# EAGLE schematic dashboard (EAGLE 6.3)
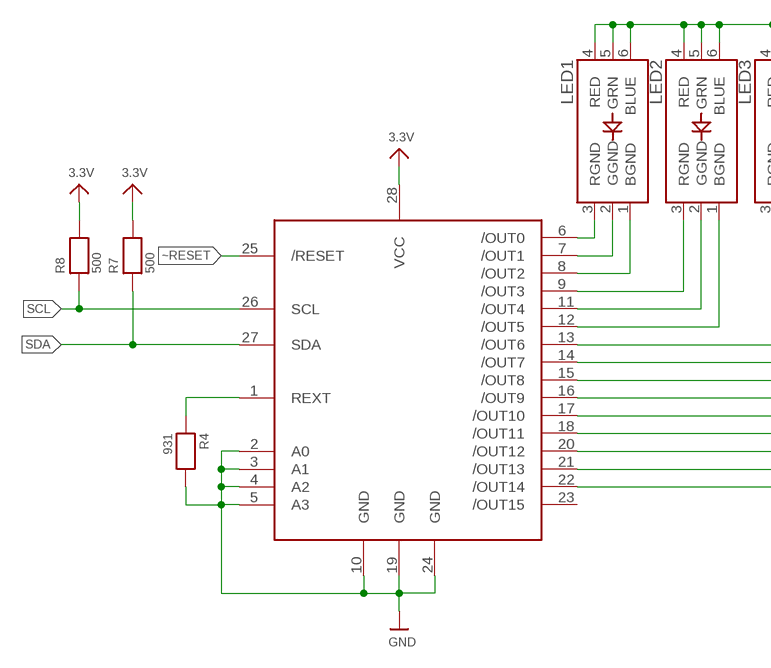
[diagram p0: schematic, sheet 1, part 1 of 2]
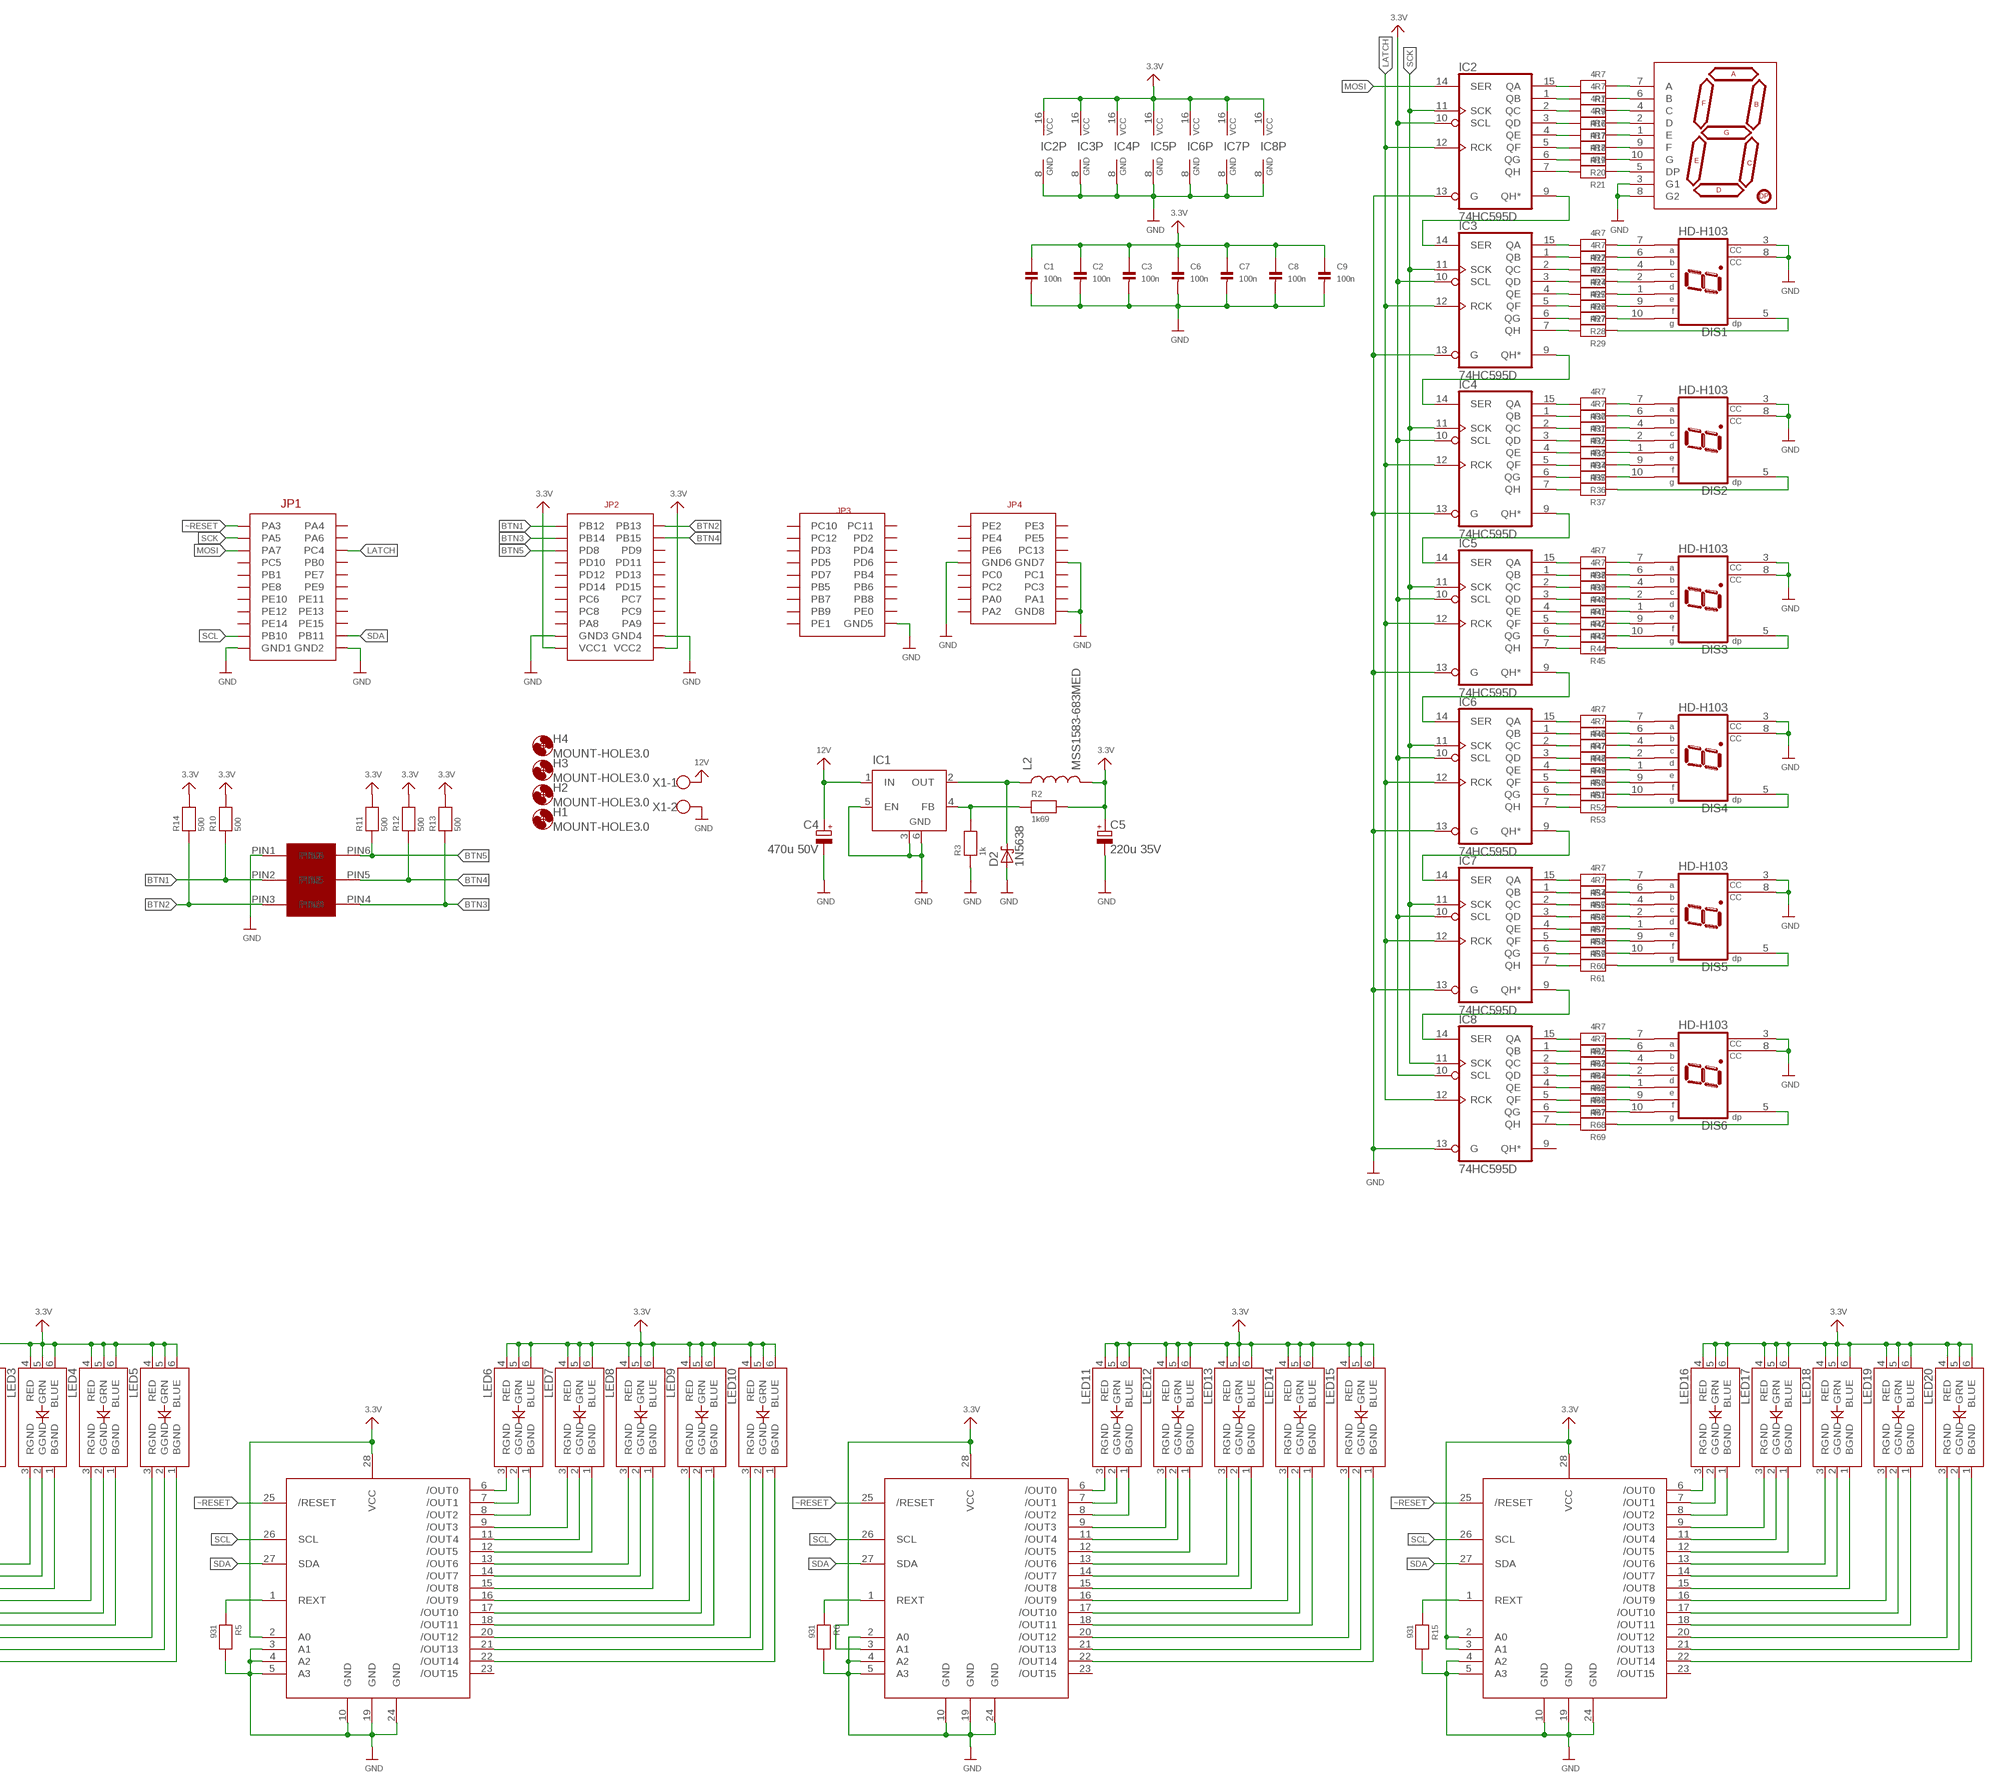
[diagram p1: schematic, sheet 1, part 2 of 2]

## Parts
C1  100n  CAP_CERAMIC_0603  [_0603]
C2  100n  CAP_CERAMIC_0603  [_0603]
C3  100n  CAP_CERAMIC_0603  [_0603]
C4  470u 50V  CPOL-EUE5-13  [E5-13]
C5  220u 35V  CPOL-EUE3.5-8  [E3,5-8]
C6  100n  CAP_CERAMIC_0603  [_0603]
C7  100n  CAP_CERAMIC_0603  [_0603]
C8  100n  CAP_CERAMIC_0603  [_0603]
C9  100n  CAP_CERAMIC_0603  [_0603]
D2  1N5638  [DO13M]
DIS1  HD-H103  [HDSP-M]
DIS2  HD-H103  [HDSP-M]
DIS3  HD-H103  [HDSP-M]
DIS4  HD-H103  [HDSP-M]
DIS5  HD-H103  [HDSP-M]
DIS6  HD-H103  [HDSP-M]
H1  MOUNT-HOLE3.0  [3,0]
H2  MOUNT-HOLE3.0  [3,0]
H3  MOUNT-HOLE3.0  [3,0]
H4  MOUNT-HOLE3.0  [3,0]
IC1  LM2596S  [TO263-5]
IC2  74HC595D  [SO16]
IC3  74HC595D  [SO16]
IC4  74HC595D  [SO16]
IC5  74HC595D  [SO16]
IC6  74HC595D  [SO16]
IC7  74HC595D  [SO16]
IC8  74HC595D  [SO16]
L2  MSS1583-683MED  INDUCTORPWR  [CDRH125]
LED1  LED_RGB_PLCC6CREE-CLV6A  [RGBLED_PLCC6]
LED2  LED_RGB_PLCC6CREE-CLV6A  [RGBLED_PLCC6]
LED3  LED_RGB_PLCC6CREE-CLV6A  [RGBLED_PLCC6]
LED4  LED_RGB_PLCC6CREE-CLV6A  [RGBLED_PLCC6]
LED5  LED_RGB_PLCC6CREE-CLV6A  [RGBLED_PLCC6]
LED6  LED_RGB_PLCC6CREE-CLV6A  [RGBLED_PLCC6]
LED7  LED_RGB_PLCC6CREE-CLV6A  [RGBLED_PLCC6]
LED8  LED_RGB_PLCC6CREE-CLV6A  [RGBLED_PLCC6]
LED9  LED_RGB_PLCC6CREE-CLV6A  [RGBLED_PLCC6]
LED10  LED_RGB_PLCC6CREE-CLV6A  [RGBLED_PLCC6]
LED11  LED_RGB_PLCC6CREE-CLV6A  [RGBLED_PLCC6]
LED12  LED_RGB_PLCC6CREE-CLV6A  [RGBLED_PLCC6]
LED13  LED_RGB_PLCC6CREE-CLV6A  [RGBLED_PLCC6]
LED14  LED_RGB_PLCC6CREE-CLV6A  [RGBLED_PLCC6]
LED15  LED_RGB_PLCC6CREE-CLV6A  [RGBLED_PLCC6]
LED16  LED_RGB_PLCC6CREE-CLV6A  [RGBLED_PLCC6]
LED17  LED_RGB_PLCC6CREE-CLV6A  [RGBLED_PLCC6]
LED18  LED_RGB_PLCC6CREE-CLV6A  [RGBLED_PLCC6]
LED19  LED_RGB_PLCC6CREE-CLV6A  [RGBLED_PLCC6]
LED20  LED_RGB_PLCC6CREE-CLV6A  [RGBLED_PLCC6]
R1  4R7  RESISTOR_0603  [_0603]
R2  1k69  RESISTOR_0603  [_0603]
R3  1k  RESISTOR_0603  [_0603]
R4  931  RESISTOR_0603  [_0603]
R5  931  RESISTOR_0603  [_0603]
R6  931  RESISTOR_0603  [_0603]
R7  500  RESISTOR_0603  [_0603]
R8  500  RESISTOR_0603  [_0603]
R9  4R7  RESISTOR_0603  [_0603]
R10  500  RESISTOR_0805  [_0805]
R11  500  RESISTOR_0805  [_0805]
R12  500  RESISTOR_0805  [_0805]
R13  500  RESISTOR_0805  [_0805]
R14  500  RESISTOR_0805  [_0805]
R15  931  RESISTOR_0603  [_0603]
R16  4R7  RESISTOR_0603  [_0603]
R17  4R7  RESISTOR_0603  [_0603]
R18  4R7  RESISTOR_0603  [_0603]
R19  4R7  RESISTOR_0603  [_0603]
R20  4R7  RESISTOR_0603  [_0603]
R21  4R7  RESISTOR_0603  [_0603]
R22  4R7  RESISTOR_0603  [_0603]
R23  4R7  RESISTOR_0603  [_0603]
R24  4R7  RESISTOR_0603  [_0603]
R25  4R7  RESISTOR_0603  [_0603]
R26  4R7  RESISTOR_0603  [_0603]
R27  4R7  RESISTOR_0603  [_0603]
R28  4R7  RESISTOR_0603  [_0603]
R29  4R7  RESISTOR_0603  [_0603]
R30  4R7  RESISTOR_0603  [_0603]
R31  4R7  RESISTOR_0603  [_0603]
R32  4R7  RESISTOR_0603  [_0603]
R33  4R7  RESISTOR_0603  [_0603]
R34  4R7  RESISTOR_0603  [_0603]
R35  4R7  RESISTOR_0603  [_0603]
R36  4R7  RESISTOR_0603  [_0603]
R37  4R7  RESISTOR_0603  [_0603]
R38  4R7  RESISTOR_0603  [_0603]
R39  4R7  RESISTOR_0603  [_0603]
R40  4R7  RESISTOR_0603  [_0603]
R41  4R7  RESISTOR_0603  [_0603]
R42  4R7  RESISTOR_0603  [_0603]
R43  4R7  RESISTOR_0603  [_0603]
R44  4R7  RESISTOR_0603  [_0603]
R45  4R7  RESISTOR_0603  [_0603]
R46  4R7  RESISTOR_0603  [_0603]
R47  4R7  RESISTOR_0603  [_0603]
R48  4R7  RESISTOR_0603  [_0603]
R49  4R7  RESISTOR_0603  [_0603]
R50  4R7  RESISTOR_0603  [_0603]
R51  4R7  RESISTOR_0603  [_0603]
R52  4R7  RESISTOR_0603  [_0603]
R53  4R7  RESISTOR_0603  [_0603]
R54  4R7  RESISTOR_0603  [_0603]
R55  4R7  RESISTOR_0603  [_0603]
R56  4R7  RESISTOR_0603  [_0603]
R57  4R7  RESISTOR_0603  [_0603]
R58  4R7  RESISTOR_0603  [_0603]
R59  4R7  RESISTOR_0603  [_0603]
R60  4R7  RESISTOR_0603  [_0603]
R61  4R7  RESISTOR_0603  [_0603]
R62  4R7  RESISTOR_0603  [_0603]
R63  4R7  RESISTOR_0603  [_0603]
R64  4R7  RESISTOR_0603  [_0603]
R65  4R7  RESISTOR_0603  [_0603]
R66  4R7  RESISTOR_0603  [_0603]
R67  4R7  RESISTOR_0603  [_0603]
R68  4R7  RESISTOR_0603  [_0603]
R69  4R7  RESISTOR_0603  [_0603]
U$1  CPU-BOARD  [CPU-BOARD-JP1]
U$9  7-SEGMENT-DISPLAY-1"-RED  [7-SEGMENT-1"PTH]
U$30  TLC59116  [TSSOP28]
U$33  TLC59116  [TSSOP28]
U$36  TLC59116  [TSSOP28]
U$42  MICROFIT6  [MICROFIT6SOCK]
U$51  TLC59116  [TSSOP28]
X1  W237-102  [W237-102]

## Nets
3.3V: C1.1 C2.1 C3.1 C5.+ C6.1 C7.1 C8.1 C9.1 IC2.10(SCL) IC2.16(VCC) IC3.10(SCL) IC3.16(VCC) IC4.10(SCL) IC4.16(VCC) IC5.10(SCL) IC5.16(VCC) IC6.10(SCL) IC6.16(VCC) IC7.10(SCL) IC7.16(VCC) IC8.10(SCL) IC8.16(VCC) L2.2 LED1.4(RED) LED1.5(GRN) LED1.6(BLUE) LED2.4(RED) LED2.5(GRN) LED2.6(BLUE) LED3.4(RED) LED3.5(GRN) LED3.6(BLUE) LED4.4(RED) LED4.5(GRN) LED4.6(BLUE) LED5.4(RED) LED5.5(GRN) LED5.6(BLUE) LED6.4(RED) LED6.5(GRN) LED6.6(BLUE) LED7.4(RED) LED7.5(GRN) LED7.6(BLUE) LED8.4(RED) LED8.5(GRN) LED8.6(BLUE) LED9.4(RED) LED9.5(GRN) LED9.6(BLUE) LED10.4(RED) LED10.5(GRN) LED10.6(BLUE) LED11.4(RED) LED11.5(GRN) LED11.6(BLUE) LED12.4(RED) LED12.5(GRN) LED12.6(BLUE) LED13.4(RED) LED13.5(GRN) LED13.6(BLUE) LED14.4(RED) LED14.5(GRN) LED14.6(BLUE) LED15.4(RED) LED15.5(GRN) LED15.6(BLUE) LED16.4(RED) LED16.5(GRN) LED16.6(BLUE) LED17.4(RED) LED17.5(GRN) LED17.6(BLUE) LED18.4(RED) LED18.5(GRN) LED18.6(BLUE) LED19.4(RED) LED19.5(GRN) LED19.6(BLUE) LED20.4(RED) LED20.5(GRN) LED20.6(BLUE) R2.2 R7.2 R8.2 R10.2 R11.2 R12.2 R13.2 R14.2 U$1.P$43(VCC1) U$1.P$44(VCC2) U$30.28(VCC) U$33.2(A0) U$33.28(VCC) U$36.3(A1) U$36.28(VCC) U$51.2(A0) U$51.3(A1) U$51.28(VCC)
12V: C4.+ IC1.1(IN) X1.1
BTN1: R10.1 U$1.P$23(PB12) U$42.PIN2
BTN2: R14.1 U$1.P$24(PB13) U$42.PIN3
BTN3: R13.1 U$1.P$25(PB14) U$42.PIN4
BTN4: R12.1 U$1.P$26(PB15) U$42.PIN5
BTN5: R11.1 U$1.P$27(PD8) U$42.PIN6
GND: C1.2 C2.2 C3.2 C4.- C5.- C6.2 C7.2 C8.2 C9.2 D2.A DIS1.3(CC) DIS1.8(CC) DIS2.3(CC) DIS2.8(CC) DIS3.3(CC) DIS3.8(CC) DIS4.3(CC) DIS4.8(CC) DIS5.3(CC) DIS5.8(CC) DIS6.3(CC) DIS6.8(CC) IC1.3(GND) IC1.5(EN) IC1.6(GND) IC2.8(GND) IC2.13(G) IC3.8(GND) IC3.13(G) IC4.8(GND) IC4.13(G) IC5.8(GND) IC5.13(G) IC6.8(GND) IC6.13(G) IC7.8(GND) IC7.13(G) IC8.8(GND) IC8.13(G) R3.1 R4.2 R5.2 R6.2 R15.2 U$1.P$21(GND1) U$1.P$22(GND2) U$1.P$41(GND3) U$1.P$42(GND4) U$1.P$62(GND5) U$1.P$69(GND6) U$1.P$70(GND7) U$1.P$78(GND8) U$9.3(G1) U$9.8(G2) U$30.2(A0) U$30.3(A1) U$30.4(A2) U$30.5(A3) U$30.10(GND) U$30.19(GND) U$30.24(GND) U$33.3(A1) U$33.4(A2) U$33.5(A3) U$33.10(GND) U$33.19(GND) U$33.24(GND) U$36.2(A0) U$36.4(A2) U$36.5(A3) U$36.10(GND) U$36.19(GND) U$36.24(GND) U$42.PIN1 U$51.4(A2) U$51.5(A3) U$51.10(GND) U$51.19(GND) U$51.24(GND) X1.2
LATCH: IC2.12(RCK) IC3.12(RCK) IC4.12(RCK) IC5.12(RCK) IC6.12(RCK) IC7.12(RCK) IC8.12(RCK) U$1.P$6(PC4)
MOSI: IC2.14(SER) U$1.P$5(PA7)
N$1: IC2.15(QA) R1.2
N$2: IC2.1(QB) R9.2
N$3: IC2.2(QC) R16.2
N$4: IC2.3(QD) R17.2
N$5: IC2.4(QE) R18.2
N$6: IC1.4(FB) R2.1 R3.2
N$7: LED1.3(RGND) U$30.6(/OUT0)
N$8: LED1.2(GGND) U$30.7(/OUT1)
N$9: D2.C IC1.2(OUT) L2.1
N$10: LED1.1(BGND) U$30.8(/OUT2)
N$11: LED2.3(RGND) U$30.9(/OUT3)
N$12: LED2.2(GGND) U$30.11(/OUT4)
N$13: LED2.1(BGND) U$30.12(/OUT5)
N$14: LED3.3(RGND) U$30.13(/OUT6)
N$15: LED3.2(GGND) U$30.14(/OUT7)
N$16: LED3.1(BGND) U$30.15(/OUT8)
N$17: LED4.3(RGND) U$30.16(/OUT9)
N$18: LED4.2(GGND) U$30.17(/OUT10)
N$19: LED4.1(BGND) U$30.18(/OUT11)
N$20: LED5.3(RGND) U$30.20(/OUT12)
N$21: LED5.2(GGND) U$30.21(/OUT13)
N$22: LED5.1(BGND) U$30.22(/OUT14)
N$23: LED6.3(RGND) U$33.6(/OUT0)
N$24: LED6.2(GGND) U$33.7(/OUT1)
N$25: LED6.1(BGND) U$33.8(/OUT2)
N$26: LED7.3(RGND) U$33.9(/OUT3)
N$27: LED7.2(GGND) U$33.11(/OUT4)
N$28: LED7.1(BGND) U$33.12(/OUT5)
N$29: LED8.3(RGND) U$33.13(/OUT6)
N$30: LED8.2(GGND) U$33.14(/OUT7)
N$31: LED8.1(BGND) U$33.15(/OUT8)
N$32: LED9.3(RGND) U$33.16(/OUT9)
N$33: LED9.2(GGND) U$33.17(/OUT10)
N$34: LED9.1(BGND) U$33.18(/OUT11)
N$35: LED10.3(RGND) U$33.20(/OUT12)
N$36: LED10.2(GGND) U$33.21(/OUT13)
N$37: LED10.1(BGND) U$33.22(/OUT14)
N$38: LED11.3(RGND) U$36.6(/OUT0)
N$39: LED11.2(GGND) U$36.7(/OUT1)
N$40: LED11.1(BGND) U$36.8(/OUT2)
N$41: LED12.3(RGND) U$36.9(/OUT3)
N$42: LED12.2(GGND) U$36.11(/OUT4)
N$43: LED12.1(BGND) U$36.12(/OUT5)
N$44: LED13.3(RGND) U$36.13(/OUT6)
N$45: LED13.2(GGND) U$36.14(/OUT7)
N$46: LED13.1(BGND) U$36.15(/OUT8)
N$47: LED14.3(RGND) U$36.16(/OUT9)
N$48: LED14.2(GGND) U$36.17(/OUT10)
N$49: LED14.1(BGND) U$36.18(/OUT11)
N$50: LED15.3(RGND) U$36.20(/OUT12)
N$51: LED15.2(GGND) U$36.21(/OUT13)
N$52: LED15.1(BGND) U$36.22(/OUT14)
N$53: R4.1 U$30.1(REXT)
N$54: LED16.3(RGND) U$51.6(/OUT0)
N$55: R5.1 U$33.1(REXT)
N$56: R6.1 U$36.1(REXT)
N$57: IC2.5(QF) R19.2
N$58: IC2.6(QG) R20.2
N$59: R1.1 U$9.7(A)
N$60: R9.1 U$9.6(B)
N$61: R16.1 U$9.4(C)
N$62: LED16.2(GGND) U$51.7(/OUT1)
N$63: LED16.1(BGND) U$51.8(/OUT2)
N$64: LED17.3(RGND) U$51.9(/OUT3)
N$65: LED17.2(GGND) U$51.11(/OUT4)
N$66: LED17.1(BGND) U$51.12(/OUT5)
N$67: LED18.3(RGND) U$51.13(/OUT6)
N$68: LED18.2(GGND) U$51.14(/OUT7)
N$69: LED18.1(BGND) U$51.15(/OUT8)
N$70: LED19.3(RGND) U$51.16(/OUT9)
N$71: LED19.2(GGND) U$51.17(/OUT10)
N$72: LED19.1(BGND) U$51.18(/OUT11)
N$73: LED20.3(RGND) U$51.20(/OUT12)
N$74: LED20.2(GGND) U$51.21(/OUT13)
N$75: LED20.1(BGND) U$51.22(/OUT14)
N$76: R15.1 U$51.1(REXT)
N$77: R17.1 U$9.2(D)
N$79: R18.1 U$9.1(E)
N$80: R19.1 U$9.9(F)
N$81: R20.1 U$9.10(G)
N$82: R21.1 U$9.5(DP)
N$83: IC2.7(QH) R21.2
N$84: IC3.15(QA) R22.2
N$85: IC3.1(QB) R23.2
N$86: IC3.2(QC) R24.2
N$87: IC3.3(QD) R25.2
N$88: IC3.4(QE) R26.2
N$89: IC3.5(QF) R27.2
N$90: IC3.6(QG) R28.2
N$91: IC3.7(QH) R29.2
N$92: DIS1.7(A) R22.1
N$93: DIS1.6(B) R23.1
N$94: DIS1.4(C) R24.1
N$95: DIS1.2(D) R25.1
N$96: DIS1.1(E) R26.1
N$97: DIS1.9(F) R27.1
N$98: DIS1.10(G) R28.1
N$99: IC4.15(QA) R30.2
N$100: IC4.1(QB) R31.2
N$101: IC4.2(QC) R32.2
N$102: IC4.3(QD) R33.2
N$103: IC4.4(QE) R34.2
N$104: IC4.5(QF) R35.2
N$105: IC4.6(QG) R36.2
N$106: IC4.7(QH) R37.2
N$107: DIS2.7(A) R30.1
N$108: DIS2.6(B) R31.1
N$109: DIS2.4(C) R32.1
N$110: DIS2.2(D) R33.1
N$111: DIS2.1(E) R34.1
N$112: DIS2.9(F) R35.1
N$113: DIS2.10(G) R36.1
N$114: DIS3.7(A) R38.1
N$115: DIS3.6(B) R39.1
N$116: DIS3.4(C) R40.1
N$117: DIS3.2(D) R41.1
N$118: DIS3.1(E) R42.1
N$119: DIS3.9(F) R43.1
N$120: DIS3.10(G) R44.1
N$121: IC5.15(QA) R38.2
N$122: IC5.1(QB) R39.2
N$123: IC5.2(QC) R40.2
N$124: IC5.3(QD) R41.2
N$125: IC5.4(QE) R42.2
N$126: IC5.5(QF) R43.2
N$127: IC5.6(QG) R44.2
N$128: IC5.7(QH) R45.2
N$129: IC6.15(QA) R46.2
N$130: IC6.1(QB) R47.2
N$131: IC6.2(QC) R48.2
N$132: IC6.3(QD) R49.2
N$133: IC6.4(QE) R50.2
N$134: IC6.5(QF) R51.2
N$135: IC6.6(QG) R52.2
N$136: IC6.7(QH) R53.2
N$137: DIS4.7(A) R46.1
N$138: DIS4.6(B) R47.1
N$139: DIS4.4(C) R48.1
N$140: DIS4.2(D) R49.1
N$141: DIS4.1(E) R50.1
N$142: DIS4.9(F) R51.1
N$143: DIS4.10(G) R52.1
N$144: IC7.15(QA) R54.2
N$145: IC7.1(QB) R55.2
N$146: IC7.2(QC) R56.2
N$147: IC7.3(QD) R57.2
N$148: IC7.4(QE) R58.2
N$149: IC7.5(QF) R59.2
N$150: IC7.6(QG) R60.2
N$151: IC7.7(QH) R61.2
N$152: DIS5.7(A) R54.1
N$153: DIS5.6(B) R55.1
N$154: DIS5.4(C) R56.1
N$155: DIS5.2(D) R57.1
N$156: DIS5.1(E) R58.1
N$157: DIS5.9(F) R59.1
N$158: DIS5.10(G) R60.1
N$159: IC8.15(QA) R62.2
N$160: IC8.1(QB) R63.2
N$161: IC8.2(QC) R64.2
N$162: IC8.3(QD) R65.2
N$163: IC8.4(QE) R66.2
N$164: IC8.5(QF) R67.2
N$165: IC8.6(QG) R68.2
N$166: IC8.7(QH) R69.2
N$167: DIS6.7(A) R62.1
N$168: DIS6.6(B) R63.1
N$169: DIS6.4(C) R64.1
N$170: DIS6.2(D) R65.1
N$171: DIS6.1(E) R66.1
N$172: DIS6.9(F) R67.1
N$173: DIS6.10(G) R68.1
N$174: IC2.9(QH*) IC3.14(SER)
N$175: DIS1.5(DP) R29.1
N$176: DIS2.5(DP) R37.1
N$177: DIS3.5(DP) R45.1
N$178: DIS4.5(DP) R53.1
N$179: DIS5.5(DP) R61.1
N$180: DIS6.5(DP) R69.1
N$181: IC3.9(QH*) IC4.14(SER)
N$182: IC4.9(QH*) IC5.14(SER)
N$183: IC5.9(QH*) IC6.14(SER)
N$184: IC6.9(QH*) IC7.14(SER)
N$185: IC7.9(QH*) IC8.14(SER)
SCK: IC2.11(SCK) IC3.11(SCK) IC4.11(SCK) IC5.11(SCK) IC6.11(SCK) IC7.11(SCK) IC8.11(SCK) U$1.P$3(PA5)
SCL: R8.1 U$1.P$19(PB10) U$30.26(SCL) U$33.26(SCL) U$36.26(SCL) U$51.26(SCL)
SDA: R7.1 U$1.P$20(PB11) U$30.27(SDA) U$33.27(SDA) U$36.27(SDA) U$51.27(SDA)
~RESET: U$1.P$1(PA3) U$30.25(/RESET) U$33.25(/RESET) U$36.25(/RESET) U$51.25(/RESET)
Unconnected: IC8.9(QH*) U$1.P$2(PA4) U$1.P$4(PA6) U$1.P$7(PC5) U$1.P$8(PB0) U$1.P$9(PB1) U$1.P$10(PE7) U$1.P$11(PE8) U$1.P$12(PE9) U$1.P$13(PE10) U$1.P$14(PE11) U$1.P$15(PE12) U$1.P$16(PE13) U$1.P$17(PE14) U$1.P$18(PE15) U$1.P$28(PD9) U$1.P$29(PD10) U$1.P$30(PD11) U$1.P$31(PD12) U$1.P$32(PD13) U$1.P$33(PD14) U$1.P$34(PD15) U$1.P$35(PC6) U$1.P$36(PC7) U$1.P$37(PC8) U$1.P$38(PC9) U$1.P$39(PA8) U$1.P$40(PA9) U$1.P$45(PC10) U$1.P$46(PC11) U$1.P$47(PC12) U$1.P$48(PD2) U$1.P$49(PD3) U$1.P$50(PD4) U$1.P$51(PD5) U$1.P$52(PD6) U$1.P$53(PD7) U$1.P$54(PB4) U$1.P$55(PB5) U$1.P$56(PB6) U$1.P$57(PB7) U$1.P$58(PB8) U$1.P$59(PB9) U$1.P$60(PE0) U$1.P$61(PE1) U$1.P$63(PE2) U$1.P$64(PE3) U$1.P$65(PE4) U$1.P$66(PE5) U$1.P$67(PE6) U$1.P$68(PC13) U$1.P$71(PC0) U$1.P$72(PC1) U$1.P$73(PC2) U$1.P$74(PC3) U$1.P$75(PA0) U$1.P$76(PA1) U$1.P$77(PA2) U$30.23(/OUT15) U$33.23(/OUT15) U$36.23(/OUT15) U$51.23(/OUT15)

## Library data of the parts
C1-C3 C6-C9 = microbuilder:CAP_CERAMIC: Ceramic Capacitors 0402 - 0402 Surface Mount Capacitors 16pF 50V 5% [Digikey: 445-4899-2-ND] 18pF 50V 5% [Digikey: 490-1281-2-ND] 22pF 50V 5% [Digikey: 490-1283-2-ND] 68pF 50V 5% [Digikey: 490-1289-2-ND] 0.1uF 10V 10% [Digikey: 490-1318-2-ND] 1.0uF 6.3V 10% [Digikey: 490-1320-2-ND] 0603 - 0603 Surface Mount Capacitors 16 pF 50V 5% [Digikey: 445-5051-2-ND] 22 pF 50V [Digikey: PCC220ACVTR-ND] 33 pF 50V 5% [Digikey: 490-1415-1-ND] 56pF 50V 5% [Digikey: 490-1421-1-ND] 220pF 50V 5% [Digikey: 445-1285-1-ND] 680 pF 50V 2200 pF 50V 5% C0G [Digikey: 445-1297-1-ND] 5600 pF 100V 5% X7R [Digikey: 478-3711-1-ND] 0.1 µF 25V 10% [Digikey: PCC2277TR-ND] 0.22 µF 16V 10% X7R [Digikey: 445-1318-1-ND] 1.0 µF 25V 10% [Digikey: 445-5146-2-ND] 0603 - RF Specific 3pF 250V +/-0.1pF RF [Digikey: 712-1347-1-ND] 18 pF 250V 5% [Digikey: 478-3505-1-ND or 712-1322-1-ND] 56 pF 250V 5% C0G RF [Digikey: 490-4867-1-ND] 68 pF 250V RF [Digikey: 490-4868-1-ND] 0805 - 0805 Surface Mount Capacitors 220 pF 250V 2% RF Ceramic Capacitor [Digikey: 712-1398-1-ND] 1000 pF 50V 2% NP0 Ceramic Capacitor [Digikey: 478-3760-1-ND] 0.1 µF 25V 10% Ceramic Capacitor [Digikey: PCC1828TR-ND] 1.0 µF 16V 10% Ceramic Capacitor[Digikey: 490-1691-2-ND] 10.0 µF 10V 10% Ceramic Capacitor[Digikey: 709-1228-1-ND] 10.0 uF 16V 10% Ceramic Capacitor [Digikey: 478-5165-2-ND] 47 uF 6.3V 20% Ceramic Capacitor [Digikey: 587-1779-1-ND or 399-5506-1-ND] 1206 - 1206 Surface Mount Capacitors 47uF 10V 20% Ceramic Capacitor [Digikey: 490-5528-1-ND or 399-5508-1-ND or 445-6010-1-ND] 100uF 6.3V -20%, +80% Y5V Ceramic Capacitor (Digikey: 490-4512-1-ND, Mouser: 81-GRM31CF50J107ZE1L)
C4 C5 = rcl:CPOL-EU: POLARIZED CAPACITOR, European symbol
D2 = diode:1N5638: DIODE schottky
DIS1-DIS6 = display-hp:HD-H103: LED DISPLAY 1-character 7 segment, decimal point right; OC_FARNELL: unknown; OC_NEWARK: unknown
H1-H4 = holes:MOUNT-HOLE: MOUNTING HOLE with drill center marker
IC1 = linear:LM2596S: STEP-DOWN VOLTAGE REGULATOR
IC2-IC8 = 74xx-eu:74*595: 8-bit SHIFT REGISTER, output latch
L2 = SparkFun-Passives:INDUCTOR: Inductors Basic Inductor/Choke - 0603 and 1206. Footprints are not proven and vary greatly between part numbers. INDUCTOR POWER 3.3UH 4.0A SMD 0.197" L x 0.197" W x 0.177" H (5.00mm x 5.00mm x 4.50mm)
LED1-LED20 = microbuilder:LED_RGB_PLCC6: RGB LED Cree CLV6A-FKB - Digikey: CLV6A-FKB-CK1P1G1BB7R3R3TR-ND DC Foreward Current: 20mA Foreward Voltage: R = 2.0, G = 3.2, B = 3.2 Viewing Angle: 120°
R1-R69 = microbuilder:RESISTOR: Resistors 0402 - 0402 Surface Mount Package 22 Ohm 1% 1/16W [Digikey: 311-22.0LRTR-ND] 33 Ohm 5% 1/16W 1.0K 5% 1/16W 1.5K 5% 1/16W 2.0K 1% 1/16W 10.0K 1% 1/16W [Digikey: 311-10.0KLRTR-ND] 10.0K 5% 1/16W [Digikey: RMCF0402JT10K0TR-ND] 12.1K 1% 1/16W [Digikey: 311-22.0LRTR-ND] 100.0K 5% 1/16W 0603 - 0603 Surface Mount Package 0 Ohm 1/10 Watt 1% Resistor 15 Ohm 1/10 Watt 1% Resistor 33 Ohm 1/10 Watt 1% Resistor 49.9 Ohm 1/10 Watt 1% Resistor 100 Ohm 1/10 Watt 1% Resistor 150 Ohm 1/10 Watt 1% Resistor 240 Ohm 1/10 Watt 1% Resistor 390 Ohm 1/10 Watt 1% Resistor 560 Ohm 1/10 Watt 1% Resistor 680 Ohm 1/10 Watt 1% Resistor 750 Ohm 1/10 Watt 1% Resistor 1.0K Ohm 1/10 Watt 1% Resistor 1.5K Ohm 1/10 Watt 1% Resistor 2.0K Ohm 1/10 Watt 1% Resistor 2.2K Ohm 1/10 Watt 1% Resistor 3.3K Ohm 1/10 Watt 1% Resistor 4.7K Ohm 1/10 Watt 1% Resistor 10.0K Ohm 1/10 Watt 1% Resistor 12.0K Ohm 1/10 Watt 1% Resistor 12.1K Ohm 1/10 Watt 1% Resistor 20.0K Ohm 1/10 Watt 1% Resistor 33.0K Ohm 1/10 Watt 1% Resistor 100.0K Ohm 1/10 Watt 1% Resistor 0805 - 0805 Surface Mount Package 0 Ohm 1/8 Watt 1% Resistor 33 Ohm 1/8 Watt 1% Resistor 100 Ohm 1/8 Watt 1% Resistor 150 Ohm 1/8 Watt 1% Resistor 200 Ohm 1/8 Watt 1% Resistor 240 Ohm 1/8 Watt 1% Resistor 330 Ohm 1/8 Watt 1% Resistor 390 Ohm 1/8 Watt 1% Resistor 470 Ohm 1/8 Watt 1% Resistor 1.0K Ohm 1/8 Watt 1% Resistor 1.5K Ohm 1/8 Watt 1% Resistor 2.0K Ohm 1/8 Watt 1% Resistor 4.7K Ohm 1/8 Watt 1% Resistor 5.1K Ohm 1/8 Watt 1% Resistor 5.6K Ohm 1/8 Watt 1% Resistor 10.0K Ohm 1/8 Watt 1% Resistor 22.0K Ohm 1/8 Watt 1% Resistor 33.0K Ohm 1/8 Watt 1% Resistor 100K Ohm 1/8 Watt 1% Resistor 1206 - 1206 Surface Mount Package 2012 - 2010 Surface Mount Package 0.11 Ohm 1/2 Watt 1% Resistor - Digikey: RHM.11UCT-ND
U$1 = unicorn_v2:CPU-BOARD
U$9 = SparkFun-Displays:7-SEGMENT-DISPLAY-1"-RED: 7-Segment Display 1" Red (COM-08546) EZ is for kits. Pads are only exposed on the bottom side to help prevent soldering in upside down.
U$30 U$33 U$36 U$51 = tlc:TLC59116
U$42 = unicorn:MICROFIT6
X1 = con-wago-500:W237-102: WAGO SCREW CLAMP; MPN: 237-102; OC_FARNELL: unknown; OC_NEWARK: 70K9898